# Altium project STM32F103ZET6_MinSystem.PrjPcb
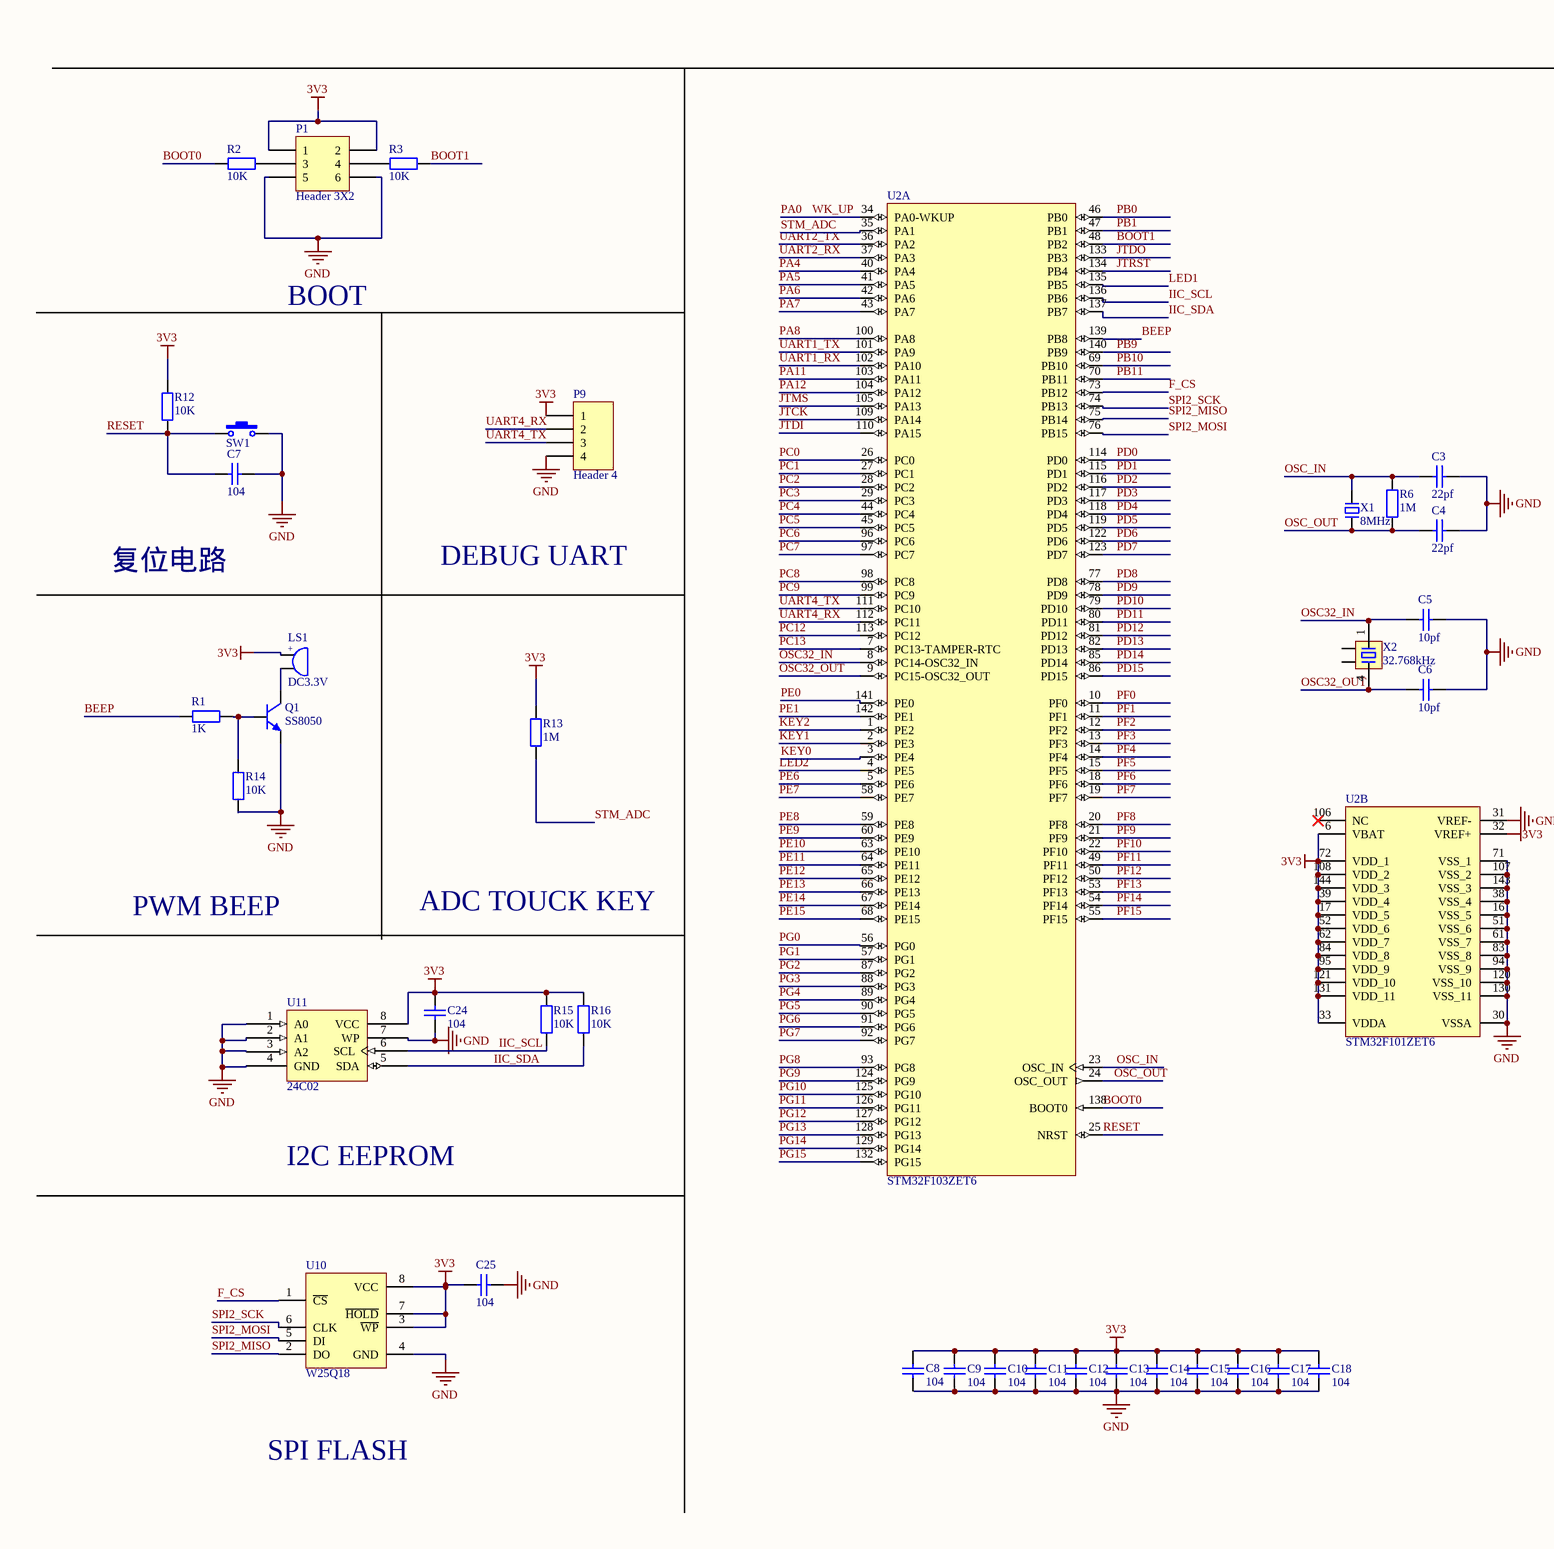
[diagram p0: STM32F103ZET6_MinSystem.SchDoc, left]
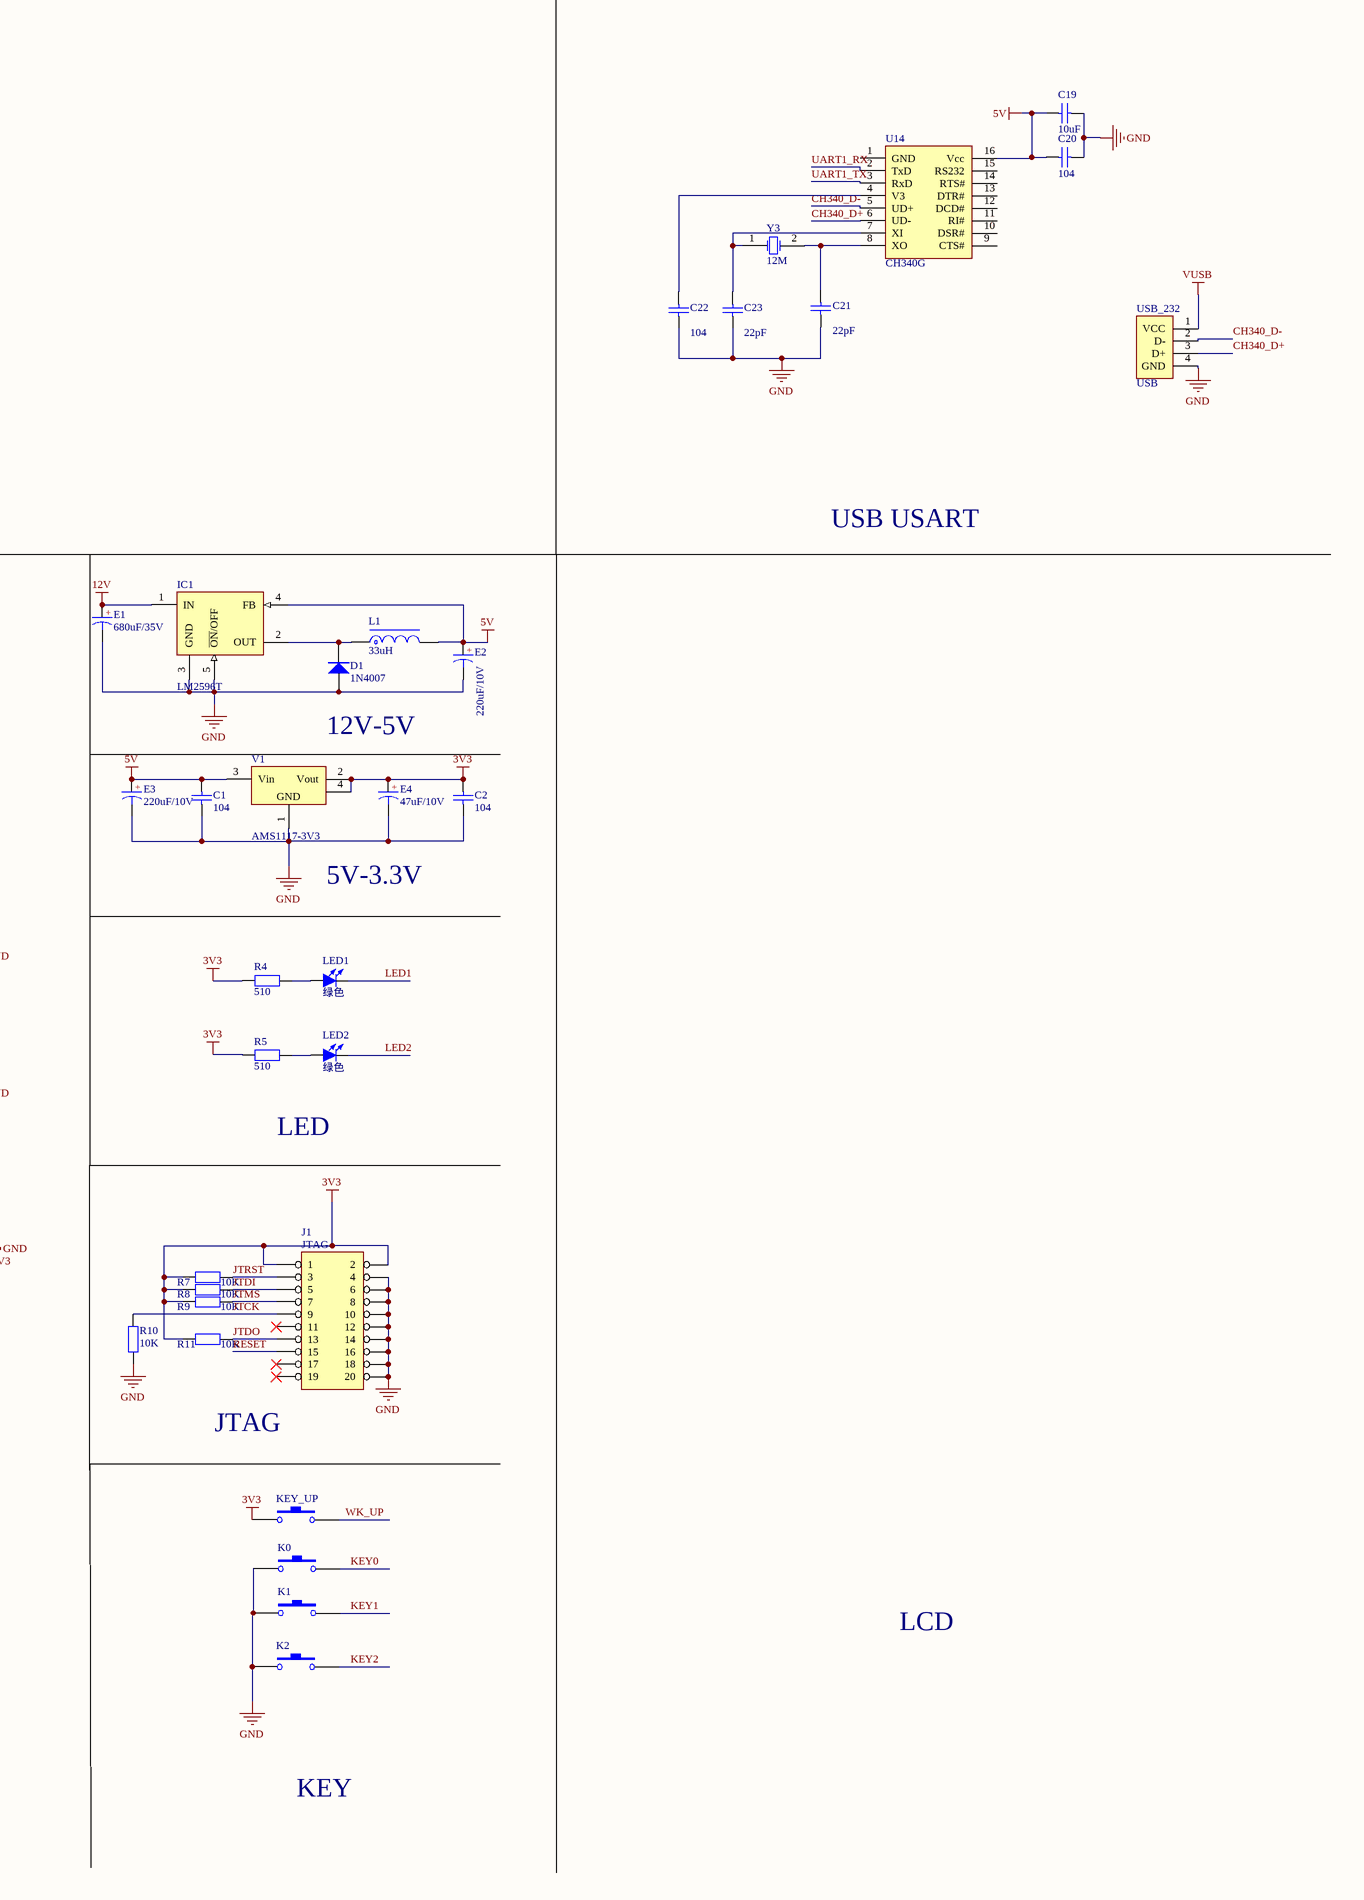
[diagram p1: STM32F103ZET6_MinSystem.SchDoc, right]
1 sheet, 69 parts. Net scope: global (net labels, ports and power ports of the same name join across sheets).

## Sheet STM32F103ZET6_MinSystem.SchDoc
size A2; SheetNumber: 1; SheetTotal: 1

### Parts
C1  104  [C0603_M]
C2  104  [C0603_M]
C3  22pf  [C0603_M]
C4  22pf  [C0603_M]
C5  10pf  [C0603_M]
C6  10pf  [C0603_M]
C7  104  [C0603_M]
C8  104  [C0603_M]
C9  104  [C0603_M]
C10  104  [C0603_M]
C11  104  [C0603_M]
C12  104  [C0603_M]
C13  104  [C0603_M]
C14  104  [C0603_M]
C15  104  [C0603_M]
C16  104  [C0603_M]
C17  104  [C0603_M]
C18  104  [C0603_M]
C19  value 10uF  [RAD-0.3]  (hidden comment: Cap)
C20  value 104  [RAD-0.3]  (hidden comment: Cap)
C21  value 22pF  [RAD-0.3]  (hidden comment: Cap)
C22  value 104  [RAD-0.3]  (hidden comment: Cap)
C23  value 22pF  [RAD-0.3]  (hidden comment: Cap)
C24  104  [C0603_M]
C25  104  [C0603_M]
D1  1N4007  [SMA]
E1  680uF/35V  [CE G(12.5*13.5)]
E2  220uF/10V  [CE D(6.3*7.7)]
E3  220uF/10V  [CE D(6.3*7.7)]
E4  47uF/10V  [CE B(4*5.4)]
IC1  LM2596T  [TO220-5A]
J1  JTAG  [JTAG_20]
K0  SW-PB  [SPST-2]  (value not drawn)
K1  SW-PB  [SPST-2]  (value not drawn)
K2  SW-PB  [SPST-2]  (value not drawn)
KEY_UP  SW-PB  [SPST-2]  (value not drawn)
L1  33uH  [CDRH74]
LED1  绿色  [LED0603_G]
LED2  绿色  [LED0603_G]
LS1  DC3.3V  [BEEP 5x9x5.5]
P1  Header 3X2  [HDR2X3]
P9  Header 4  [HDR1X4]
Q1  SS8050  [SOT23-3N]
R1  1K  [R0603_L]
R2  10K  [R0603_L]
R3  10K  [R0603_L]
R4  510  [R0603_L]
R5  510  [R0603_L]
R6  1M  [R0603_L]
R7  10K  [R0603_L]
R8  10K  [R0603_L]
R9  10K  [R0603_L]
R10  10K  [R0603_L]
R11  10K  [R0603_L]
R12  10K  [R0603_L]
R13  1M  [R0603_L]
R14  10K  [R0603_L]
R15  10K  [R0603_L]
R16  10K  [R0603_L]
SW1  3x6x5  [SW SMD-3*6*2.5]  (value not drawn)
U2  STM32F103ZET6  [LQFP144_N]  (parts A,B of 2)
U10  W25Q18  [SOP8W_N]
U11  24C02  [SOP8_L]
U14  CH340G  [SOP16_L]
USB_232  USB  [USB2.0_TYPE-B]
V1  AMS1117-3V3  [SOT223_L]
X1  8MHz  [HC-49S]
X2  32.768kHz  [MC-306]
Y3  12M  [R38]

### Nets
3V3: C2.2 C9.2 C10.2 C11.2 C12.2 C13.2 C14.2 C15.2 C16.2 C17.2 C18.2 C24.1 C25.2 E4.1 J1.1 J1.2 KEY_UP.1 LS1.1 P1.1 P1.2 P9.1 R4.1 R5.1 R7.1 R8.1 R9.1 R11.1 R12.2 R13.2 R15.2 R16.2 U2.6(VBAT) U2.17(VDD_5) U2.32(VREF+) U2.33(VDDA) U2.39(VDD_4) U2.52(VDD_6) U2.62(VDD_7) U2.72(VDD_1) U2.84(VDD_8) U2.95(VDD_9) U2.108(VDD_2) U2.121(VDD_10) U2.131(VDD_11) U2.144(VDD_3) U10.3(~{WP}) U10.7(~{HOLD}) U10.8(VCC) U11.8(VCC) V1.2(Vout) V1.4(GND)
5V: C1.2 C19.2 C20.2 E2.1 E3.1 IC1.4(FB) L1.2 U14.16(Vcc) V1.3(Vin)
12V: E1.1 IC1.1(IN)
GND: C1.1 C2.1 C3.2 C4.2 C5.2 C6.2 C7.2 C9.1 C10.1 C11.1 C12.1 C13.1 C14.1 C15.1 C16.1 C17.1 C18.1 C19.1 C20.1 C21.1 C22.1 C23.1 C24.2 C25.1 D1.1(A) E1.2 E2.2 E3.2 E4.2 IC1.3(GND) IC1.5(~{ON}/OFF) J1.4 J1.6 J1.8 J1.10 J1.12 J1.14 J1.16 J1.18 J1.20 K0.1 K1.1 K2.1 P1.5 P1.6 P9.4 Q1.2(E) R10.1 R14.1 SW1.2 U2.16(VSS_5) U2.30(VSSA) U2.31(VREF-) U2.38(VSS_4) U2.51(VSS_6) U2.61(VSS_7) U2.71(VSS_1) U2.83(VSS_8) U2.94(VSS_9) U2.107(VSS_2) U2.120(VSS_10) U2.130(VSS_11) U2.143(VSS_3) U10.4(GND) U11.1(A0) U11.2(A1) U11.3(A2) U11.4(GND) U11.7(WP) USB_232.4(GND) V1.1(GND)
VUSB: USB_232.1(VCC)
BEEP: R1.2 U2.139(PB8)
BOOT0: R2.1 U2.138(BOOT0)
BOOT1: R3.1 U2.48(PB2)
CH340_D+: U14.6(UD-) USB_232.3(D+)
CH340_D-: U14.5(UD+) USB_232.2(D-)
F_CS: U2.73(PB12) U10.1(~{CS})
IIC_SCL: R15.1 U2.136(PB6) U11.6(SCL)
IIC_SDA: U2.137(PB7)
JTCK: J1.9 R10.2 U2.109(PA14)
JTDI: J1.5 R8.2 U2.110(PA15)
JTDO: J1.13 R11.2 U2.133(PB3)
JTMS: J1.7 R9.2 U2.105(PA13)
JTRST: J1.3 R7.2 U2.134(PB4)
KEY0: K0.2 U2.3(PE4)
KEY1: K1.2 U2.2(PE3)
KEY2: K2.2 U2.1(PE2)
LED1: LED1.2(K) U2.135(PB5)
LED2: LED2.2(K) U2.4(PE5)
OSC32_IN: C5.1 U2.8(PC14-OSC32_IN) X2.1
OSC32_OUT: C6.1 U2.9(PC15-OSC32_OUT) X2.4
OSC_IN: C3.1 R6.2 U2.23(OSC_IN) X1.1
OSC_OUT: C4.1 R6.1 U2.24(OSC_OUT) X1.2
PA0: KEY_UP.2 U2.34(PA0-WKUP)  [also labelled WK_UP]
PA4: U2.40(PA4)
PA5: U2.41(PA5)
PA6: U2.42(PA6)
PA7: U2.43(PA7)
PA8: U2.100(PA8)
PA11: U2.103(PA11)
PA12: U2.104(PA12)
PB0: U2.46(PB0)
PB1: U2.47(PB1)
PB9: U2.140(PB9)
PB10: U2.69(PB10)
PB11: U2.70(PB11)
PC0: U2.26(PC0)
PC1: U2.27(PC1)
PC2: U2.28(PC2)
PC3: U2.29(PC3)
PC4: U2.44(PC4)
PC5: U2.45(PC5)
PC6: U2.96(PC6)
PC7: U2.97(PC7)
PC8: U2.98(PC8)
PC9: U2.99(PC9)
PC12: U2.113(PC12)
PC13: U2.7(PC13-TAMPER-RTC)
PD0: U2.114(PD0)
PD1: U2.115(PD1)
PD2: U2.116(PD2)
PD3: U2.117(PD3)
PD4: U2.118(PD4)
PD5: U2.119(PD5)
PD6: U2.122(PD6)
PD7: U2.123(PD7)
PD8: U2.77(PD8)
PD9: U2.78(PD9)
PD10: U2.79(PD10)
PD11: U2.80(PD11)
PD12: U2.81(PD12)
PD13: U2.82(PD13)
PD14: U2.85(PD14)
PD15: U2.86(PD15)
PE0: U2.141(PE0)
PE1: U2.142(PE1)
PE6: U2.5(PE6)
PE7: U2.58(PE7)
PE8: U2.59(PE8)
PE9: U2.60(PE9)
PE10: U2.63(PE10)
PE11: U2.64(PE11)
PE12: U2.65(PE12)
PE13: U2.66(PE13)
PE14: U2.67(PE14)
PE15: U2.68(PE15)
PF0: U2.10(PF0)
PF1: U2.11(PF1)
PF2: U2.12(PF2)
PF3: U2.13(PF3)
PF4: U2.14(PF4)
PF5: U2.15(PF5)
PF6: U2.18(PF6)
PF7: U2.19(PF7)
PF8: U2.20(PF8)
PF9: U2.21(PF9)
PF10: U2.22(PF10)
PF11: U2.49(PF11)
PF12: U2.50(PF12)
PF13: U2.53(PF13)
PF14: U2.54(PF14)
PF15: U2.55(PF15)
PG0: U2.56(PG0)
PG1: U2.57(PG1)
PG2: U2.87(PG2)
PG3: U2.88(PG3)
PG4: U2.89(PG4)
PG5: U2.90(PG5)
PG6: U2.91(PG6)
PG7: U2.92(PG7)
PG8: U2.93(PG8)
PG9: U2.124(PG9)
PG10: U2.125(PG10)
PG11: U2.126(PG11)
PG12: U2.127(PG12)
PG13: U2.128(PG13)
PG14: U2.129(PG14)
PG15: U2.132(PG15)
RESET: C7.1 J1.15 R12.1 SW1.1 U2.25(NRST)
SPI2_MISO: U2.75(PB14) U10.2(DO)
SPI2_MOSI: U2.76(PB15) U10.5(DI)
SPI2_SCK: U2.74(PB13) U10.6(CLK)
STM_ADC: R13.1 U2.35(PA1)
UART1_RX: U2.102(PA10) U14.2(TxD)
UART1_TX: U2.101(PA9) U14.3(RxD)
UART2_RX: U2.37(PA3)
UART2_TX: U2.36(PA2)
UART4_RX: P9.2 U2.112(PC11)
UART4_TX: P9.3 U2.111(PC10)
NetC21_2: C21.2 U14.8(XO) Y3.2(OSC2)
NetC22_2: C22.2 U14.4(V3)
NetC23_2: C23.2 U14.7(XI) Y3.1(OSC1)
NetD1_2: D1.2(K) IC1.2(OUT) L1.1
NetLED1_1: LED1.1(A) R4.2
NetLED2_1: LED2.1(A) R5.2
NetLS1_2: LS1.2 Q1.3(C)
NetP1_3: P1.3 R2.2
NetP1_4: P1.4 R3.2
NetQ1_1: Q1.1(B) R1.1 R14.2
NetR16_1: R16.1 U11.5(SDA)

Not connected (* = marked no-connect by the designer): C8 1 2; J1 11* 17* 19*; U2 106(NC)*; U14 1(GND) 9(CTS#) 10(DSR#) 11(RI#) 12(DCD#) 13(DTR#) 14(RTS#) 15(RS232); X2 2 3

### Notes on the sheet
- USB USART
- 12V-5V
- BOOT
- 5V-3.3V
- 复位电路
- DEBUG UART
- LED
- PWM BEEP
- ADC TOUCK KEY
- JTAG
- I2C EEPROM
- LCD
- KEY
- SPI FLASH
- Labels drawn without touching a wire or pin: IIC_SDA
- (in symbol BEEP) +
- (in symbol CE_SMD) +

### Library data of the parts
C1-C18 C24 C25 = C: 贴片电容/MLCC电容; BOM名称: 无极性贴片电容; 联系卖家，免费查找封装: 唯一出售店铺网址https://shop463601444.taobao.com
C19-C23 = Cap: Capacitor; Published: 8-Jun-2000; LatestRevisionDate: 17-Jul-2002; LatestRevisionNote: Re-released for DXP Platform.; PackageReference: RAD-0.3; Publisher: Altium Limited; PackageDescription: Radial Cap, Thru-Hole; 2 Leads; 0.3 in Pin Spacing
D1 = 1N4007: 整流二极管; 以赠品形式获赠本封装库的买家，还可联系卖家免费指导AD软件使用: 封装库来自淘宝卖家ID：黄晶宝石; BOM名称: 整流二极管
E1-E4 = CE_SMD: 贴片电解电容; 联系卖家，免费查找封装: 唯一出售店铺网址https://shop463601444.taobao.com; BOM名称: 贴片电解电容
IC1 = LM2596T: 3A DC-DC降压芯片; BOM名称: DC降压芯片; 封装库来自淘宝卖家ID：黄晶宝石: 其他店铺购入的买家，请立即申请退款，本店现金奖励20~1000元
J1 = HEADER 10X2
K0-K2 KEY_UP = SW-PB: Switch; Published: 24-Mar-1999; LatestRevisionDate: 17-Jul-2002; LatestRevisionNote: Re-released for DXP Platform.; PackageReference: SPST-2; Publisher: Altium Limited; PackageDescription: Switch; 2 Leads
L1 = L-CDRH: CDRH功率屏蔽电感; BOM名称: 功率屏蔽电感; 联系卖家，免费查找封装: 唯一出售店铺网址https://shop463601444.taobao.com
LED1 LED2 = LED-SMD: 贴片LED; 封装库来自淘宝卖家ID：黄晶宝石: 其他店铺购入均为盗版封装库，请立即申请退款，本店现金奖励20~200元; BOM名称: 贴片LED
LS1 = BEEP: 蜂鸣器; 联系下单店铺卖家 免费技术支持: 联系下单店铺卖家 免费帮你查找封装; BOM名称: 蜂鸣器
P1 = Header 3X2: Header, 3-Pin, Dual row; LatestRevisionDate: 17-Jul-2002; LatestRevisionNote: Re-released for DXP Platform.; Publisher: Altium Limited
P9 = Header 4: Header, 4-Pin; LatestRevisionDate: 17-Jul-2002; LatestRevisionNote: Re-released for DXP Platform.; Publisher: Altium Limited
Q1 = 8050-SMD: 高频放大-NPN型; 参数: 40V 1.5A 1W 100MHZ; 联系下单店铺卖家 免费帮你查找封装: 联系下单店铺卖家 免费技术支持; BOM名称: 高频放大-NPN型
R1-R16 = R: 贴片电阻; 联系卖家，免费查找封装: 唯一出售店铺网址https://shop463601444.taobao.com; BOM名称: 贴片电阻
SW1 = SW-PB: 微动开关; BOM名称: 3x6轻触开关; 联系卖家，免费查找封装: 唯一出售店铺网址https://shop463601444.taobao.com; 封装库来自淘宝卖家ID：黄晶宝石: 其他店铺购入的，请立即申请退款，本店现金奖励20~500元
U2 = STM32F101ZET6: STM32 ARM-based 32-bit MCU Access Line with 512 kB Flash, 48 kB Internal RAM, -40 to +85癈 Temperature, 144-Pin LQFP, Tray; 联系卖家，免费查找封装: 唯一出售店铺网址https://shop463601444.taobao.com; DatasheetVersion: rev8.0, Apr-2011; PackageVersion: 2011; PackageReference: LQFP144; PackageDescription: 144-Pin Thin Quad Flat Pack 0.5 mm Pitch; ComponentLink1Description: Manufacturer URL; ComponentLink1URL: http://www.st.com/; ComponentLink2Description: STM32F101 Datasheet; ComponentLink2URL: http://www.st.com/internet/com/TECHNICAL_RESOURCES/TECHNICAL_LITERATURE/DATASHEET/CD00191174.pdf; ComponentLink3Description: STM32 Family Web Page; ComponentLink3URL: www.st.com/stm32
U10 = W25Q: SPI Flash; BOM名称: 外置Flash; 封装库来自淘宝卖家：黄晶宝石: 其他店铺购入均为盗版封装库，无更新权益，退款现金奖励200~1000元; 当前库版本V2022.12.25 @淘宝卖家:黄晶宝石: 最新版本发布https://shop463601444.taobao.com
U11 = 24Cxx: 外置EEPROM; 封装库来自淘宝卖家：黄晶宝石: 其他店铺购入均为盗版封装库，无更新权益，退款现金奖励200~1000元; 当前库版本V2022.12.25 @淘宝卖家:黄晶宝石: 最新版本发布https://shop463601444.taobao.com; BOM名称: 外置EEPROM
U14 = CH340G: USB转串口芯片，外置晶振; BOM名称: 串口转USB; 芯片厂商: WCH(南京沁恒); 封装库来自淘宝卖家：黄晶宝石: 其他店铺购入均为盗版封装库，无更新权益，退款现金奖励200~1000元; 当前库版本V2022.12.25 @淘宝卖家:黄晶宝石: 最新版本发布https://shop463601444.taobao.com
USB_232 = USB2.0_Type-B: USB2.0_Type-B母座; 当前库版本V2022.12.25 @淘宝卖家:黄晶宝石: 最新版本发布https://shop463601444.taobao.com; BOM名称: USB2.0_Type-B母座
V1 = AMS1117: 三端稳压芯片; BOM名称: 稳压芯片; 封装库来自淘宝卖家ID：黄晶宝石: 其他店铺购入的买家，请立即申请退款，本店现金奖励20~1000元
X1 = XTAL-2P: 2脚无源晶振(谐振器）; 联系卖家，免费查找封装: 唯一出售店铺网址https://shop463601444.taobao.com; BOM名称: 2脚无源晶振(谐振器）
X2 = XTAL-MC-4P: MC系列4脚无源晶振(谐振器）; 联系卖家，免费查找封装: 唯一出售店铺网址https://shop463601444.taobao.com; BOM名称: MC系列4脚无源晶振(谐振器）
Y3 = XTAL: Crystal Oscillator; Published: 8-Jun-2000; LatestRevisionDate: 17-Jul-2002; LatestRevisionNote: Re-released for DXP Platform.; PackageReference: R38; Publisher: Altium Limited; PackageDescription: Crystal, Thru-Hole; 2 Leads; Body 3.1 x 8.2 mm (Dia.xH)